# Altium project lcd_ch.PrjPcb
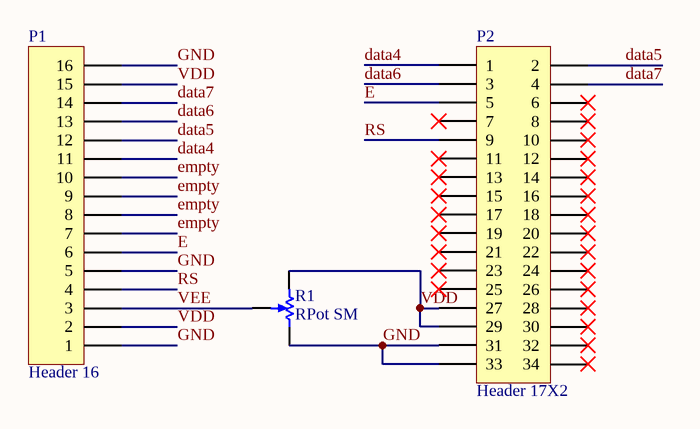
[diagram p0: lcd_ch.SchDoc]
1 sheet, 3 parts. Net scope: global (net labels, ports and power ports of the same name join across sheets).
Board file: LCD-CH.PcbDoc

## Sheet lcd_ch.SchDoc
size A

### Parts
P1  Header 16  [HDR1X16]
P2  Header 17X2  [HDR2X17]
R1  RPot SM  [pot]

### Nets
data4: P1.11 P2.1
data5: P1.12 P2.2
data6: P1.13 P2.3
data7: P1.14 P2.4
E: P1.6 P2.5
empty: P1.7 P1.8 P1.9 P1.10
GND: P1.1 P1.5 P1.16 P2.31 P2.33 R1.CW(+)
RS: P1.4 P2.9
VDD: P1.2 P1.15 P2.27 P2.29 R1.CCW(-)
VEE: P1.3 R1.W

Not connected (* = marked no-connect by the designer): P2 6* 7* 8* 10* 11* 12* 13* 14* 15* 16* 17* 18* 19* 20* 21* 22* 23* 24* 25* 26* 28* 30* 32* 34*

### Library data of the parts
P1 = Header 16: Header, 16-Pin; LatestRevisionDate: 17-Jul-2002; LatestRevisionNote: Re-released for DXP Platform.; Publisher: Altium Limited
P2 = Header 17X2: Header, 17-Pin, Dual row; LatestRevisionDate: 17-Jul-2002; LatestRevisionNote: Re-released for DXP Platform.; Publisher: Altium Limited
R1 = RPot SM: Square Trimming Potentiometer; Published: 17-Dec-2003; DatasheetVersion: Oct-2003; PackageReference: POT4MM-2; Publisher: Altium Limited; PackageDescription: Square Trimming Potentiometer; ComponentLink1Description: Manufacturer Link; ComponentLink1URL: http://bourns.com/2/search.html